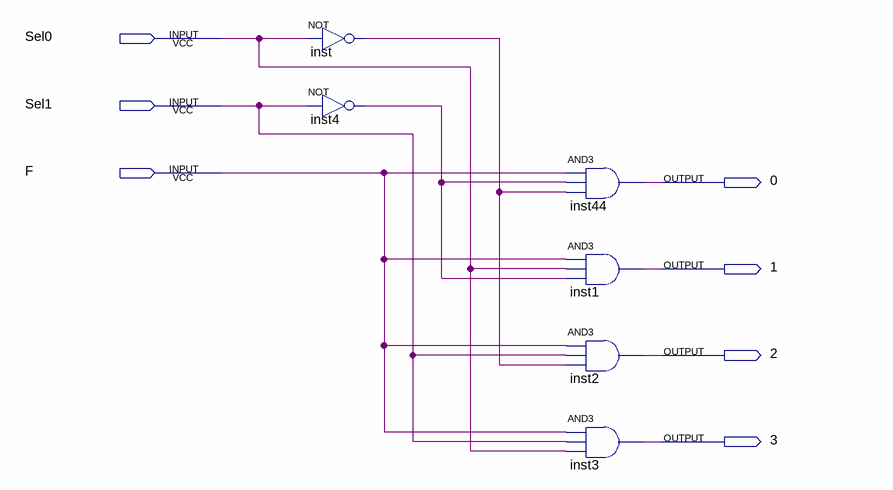
[diagram p0: schematic sheet]
// Quartus schematic 1to4_demux.bdf as structural Verilog: 6 symbols, 7 pins
module \1to4_demux  (
  input  Sel0,
  input  Sel1,
  input  F,
  output \0 ,
  output \1 ,
  output \2 ,
  output \3 
);

  wire inst4_out, inst_out;

  not inst (inst_out, Sel0);
  not inst4 (inst4_out, Sel1);
  and inst44 (\0 , F, inst4_out, inst_out);
  and inst1 (\1 , F, Sel0, inst4_out);
  and inst2 (\2 , F, Sel1, inst_out);
  and inst3 (\3 , F, Sel1, Sel0);
endmodule
